# Altium schematic sheet USB3.2_Type_A.SchDoc
size A3; SheetNumber: 6; SheetTotal: 16
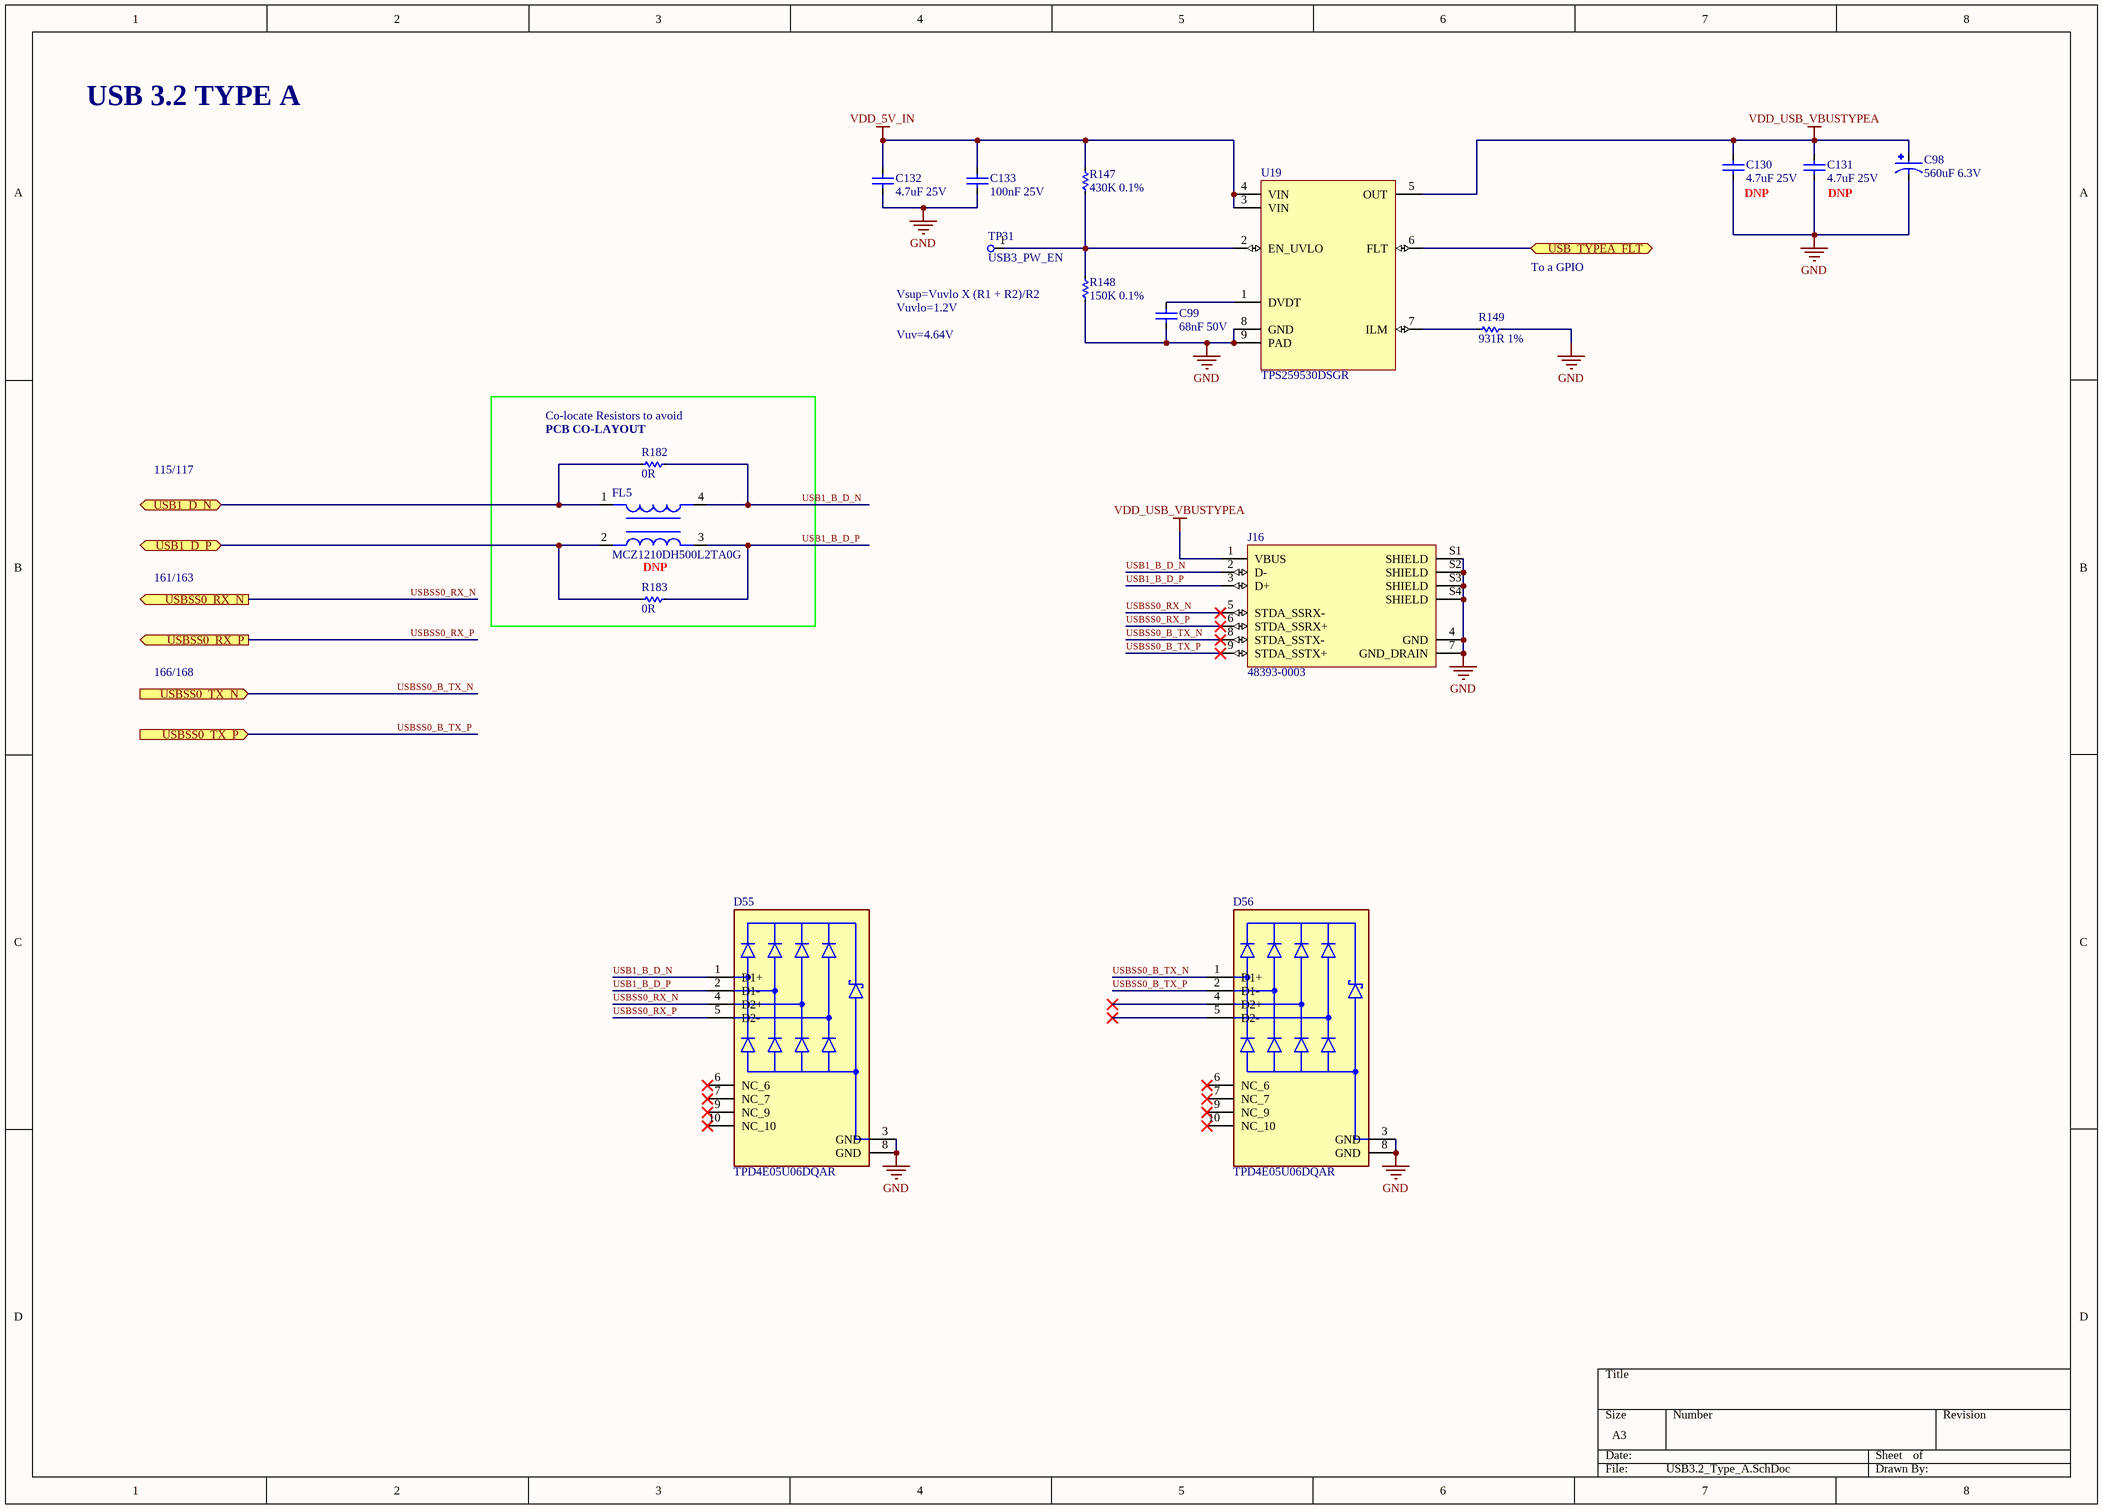
[diagram p0: USB3.2_Type_A.SchDoc]

## Parts
C98  560uF 6.3V  [CP_ELEC_8X7.7]
C99  68nF 50V  [C0805]
C130  4.7uF 25V  [C0603]
C131  4.7uF 25V  [C0603]
C132  4.7uF 25V  [C0603]
C133  100nF 25V  [C0402]
D55  TPD4E05U06DQAR  [TPD4E05U06DQAR]
D56  TPD4E05U06DQAR  [TPD4E05U06DQAR]
FL5  MCZ1210DH500L2TA0G  [MCZ1210DH500L2TA0G]
J16  48393-0003  [0483930003]
R147  430K 0.1%  [R0603]
R148  150K 0.1%  [R0402]
R149  931R 1%  [R0402]
R182  0R  [R0402]
R183  0R  [R0402]
TP31  USB3_PW_EN  [TestPoint_Pad_D1.0mm]
U19  TPS259530DSGR  [WSON(2X2)-8]

## Ports
USB1_D_N (bidir), USB1_D_P (bidir), USB_TYPEA_FLT (bidir), USBSS0_RX_N (out), USBSS0_RX_P (out), USBSS0_TX_N (in), USBSS0_TX_P (in)

## Nets
GND: C98.2(C) C99.1 C130.1 C131.1 C132.1 C133.1 D55.3(GND) D55.8(GND) D56.3(GND) D56.8(GND) J16.4(GND) J16.7(GND_DRAIN) J16.S1(SHIELD) J16.S2(SHIELD) J16.S3(SHIELD) J16.S4(SHIELD) R148.1 R149.2 U19.8(GND) U19.9(PAD)
VDD_5V_IN: C132.2 C133.2 R147.2 U19.3(VIN) U19.4(VIN)
VDD_USB_VBUSTYPEA: C98.1(A) C130.2 C131.2 J16.1(VBUS) U19.5(OUT)
USB1_B_D_N: D55.1(D1+) FL5.4 J16.2(D-) R182.2
USB1_B_D_P: D55.2(D1-) FL5.3 J16.3(D+) R183.2
USB1_D_N: FL5.1 R182.1 ; port USB1_D_N
USB1_D_P: FL5.2 R183.1 ; port USB1_D_P
USB_TYPEA_FLT: U19.6(FLT) ; port USB_TYPEA_FLT
USBSS0_B_TX_N: D56.1(D1+) J16.8(STDA_SSTX-) ; port USBSS0_TX_N
USBSS0_B_TX_P: D56.2(D1-) J16.9(STDA_SSTX+) ; port USBSS0_TX_P
USBSS0_RX_N: D55.4(D2+) J16.5(STDA_SSRX-) ; port USBSS0_RX_N
USBSS0_RX_P: D55.5(D2-) J16.6(STDA_SSRX+) ; port USBSS0_RX_P
NetC99_2: C99.2 U19.1(DVDT)
NetR147_1: R147.1 R148.2 TP31.1 U19.2(EN_UVLO)
NetR149_1: R149.1 U19.7(ILM)

Not connected (* = marked no-connect by the designer): D55 6(NC_6)* 7(NC_7)* 9(NC_9)* 10(NC_10)*; D56 4(D2+)* 5(D2-)* 6(NC_6)* 7(NC_7)* 9(NC_9)* 10(NC_10)*

## Notes on the sheet
- USB 3.2 TYPE A
- (near C130) DNP
- (near C131) DNP
- Vsup=Vuvlo X (R1 + R2)/R2
- Vuvlo=1.2V
- To a GPIO
- Vuv=4.64V
- (near R182) Co-locate Resistors to avoid
- (near R182) PCB CO-LAYOUT
- 115/117
- 161/163
- DNP
- 166/168

## Library data of the parts
C98 = RHA0J561MCN1GS: Cap Aluminum Polymer 560uF 6.3VDC 20% (8 X 7.7mm) SMD 0.009 Ohm 4500mA 2000h 105C T/R; Manufacturer: Nichicon; ESR (Equivalent Series Resistance): 9mR; Life (Hours): 2000Hour; Ripple Current: 4.5A; Leakage Current: 1.0584mA; Dissipation Factor: 0.12%; Supplier 1: Digi-Key; Manufacturer Part Number: RHA0J561MCN1GS; RoHS: Yes; Category: Polymer Capacitors; Stock 1: 37081; Pricing 1: 1=1.16000, 10=0.88500, 50=0.73500, 100=0.63290 (USD); Mount: Surface Mount; Case/Package: Radial; Min Operating Temperature: -55°C; Max Operating Temperature: 105°C; Capacitance: 560uF; Tolerance: 20%; Voltage Rating: 6.3V; Packaging: Tape and Reel; Package Quantity: 1; Voltage Rating (DC): 6.3V; Termination: SMD/SMT; Series: FPCAP, HA; Construction: Cylindrical; Diameter: 8mm; Length: 7.7mm; Width: 8.3mm; Height: 8.3mm; Height - Seated (Max): 0.303inch; Radiation Hardening: No; RoHS Compliant: Yes; ComponentLink1URL: https://datasheet.ciiva.com/16481/2009fpcap-catalog-hsha-16481370.pdf?src-supplier=Future+Electronics; ComponentLink1Description: https://datasheet.ciiva.com/16481/2009fpcap-catalog-hsha-16481370.pdf?src-supplier=Future+Electronics; ComponentLink2URL: https://datasheet.ciiva.com/101/e-hs-ha-101946.pdf?src-supplier=Digi-Key; ComponentLink2Description: https://datasheet.ciiva.com/101/e-hs-ha-101946.pdf?src-supplier=Digi-Key; ComponentLink3URL: https://datasheet.ciiva.com/101/e-hs-ha-101947.pdf?src-supplier=Digi-Key; ComponentLink3Description: https://datasheet.ciiva.com/101/e-hs-ha-101947.pdf?src-supplier=Digi-Key; ComponentLink4URL: https://datasheet.ciiva.com/101/e-hs-ha-101948.pdf?src-supplier=Digi-Key; ComponentLink4Description: https://datasheet.ciiva.com/101/e-hs-ha-101948.pdf?src-supplier=Digi-Key; Supplier Part Number 1: 493-3772-1-ND
C99 = C0805C683K5RECAUTO7210: Cap Cer 0805 68NF 50V X7R 10%; Manufacturer: KEMET; Supplier 1: Digi-Key; Manufacturer Part Number: C0805C683K5RECAUTO7210; Category: Ceramic Capacitors; Stock 1: 10000; Pricing 1: 1=0.25000, 10=0.17100, 50=0.11400, 100=0.09680, 500=0.06836, 1000=0.05981, 2500=0.05696, 5000=0.05269 (USD); RoHS Compliant: Yes; ComponentLink1URL: https://api.kemet.com/component-edge/download/datasheet/C0805C683K5RECAUTO7210.pdf?src-supplier=Digi-Key; ComponentLink1Description: https://api.kemet.com/component-edge/download/datasheet/C0805C683K5RECAUTO7210.pdf?src-supplier=Digi-Key; Supplier Part Number 1: 399-C0805C683K5RECAUTO7210CT-ND
C130-C132 = GRM188R61E475KE11D: 0603 4.7 uF 25 V ±10 % Tolerance X5R SMT Multilayer Ceramic Capacitor; Manufacturer: Murata; Tolerance: 10%; Supplier 1: Digi-Key; Manufacturer Part Number: GRM188R61E475KE11D; RoHS: Yes; Category: Ceramic Capacitors; Stock 1: 1144167; Pricing 1: 1=0.26000, 10=0.18000, 50=0.12000, 100=0.10200, 500=0.07202, 1000=0.06301 (USD); Mount: Surface Mount; Case/Package: 0603; Case Code (Metric): 1608; Case Code (Imperial): 0603; Material: Ceramic; Min Operating Temperature: -55°C; Max Operating Temperature: 85°C; Package Quantity: 1; Packaging: Cut Tape; Capacitance: 4.7uF; Voltage Rating: 25V; Dielectric: X5R; Voltage: 25V; Voltage Rating (DC): 25V; Series: GRM; Length: 0.063inch; Width: 0.031inch; Height: 0.8mm; Thickness: 0.031inch; Depth: 0.8mm; Reach SVHC Compliant: Yes; Lead Free: Lead Free; RoHS Compliant: Yes; ComponentLink1URL: https://datasheet.ciiva.com/46444/1769893-46444983.pdf?src-supplier=Element14; ComponentLink1Description: https://datasheet.ciiva.com/46444/1769893-46444983.pdf?src-supplier=Element14; ComponentLink2URL: https://datasheet.ciiva.com/46444/1769893-46444982.pdf?src-supplier=Element14; ComponentLink2Description: https://datasheet.ciiva.com/46444/1769893-46444982.pdf?src-supplier=Element14; ComponentLink3URL: https://datasheet.ciiva.com/14891/partnumbering-e-01-14891103.pdf?src-supplier=Digi-Key; ComponentLink3Description: https://datasheet.ciiva.com/14891/partnumbering-e-01-14891103.pdf?src-supplier=Digi-Key; ComponentLink4URL: https://datasheet.ciiva.com/14891/partnumbering-e-01-14891102.pdf?src-supplier=Digi-Key; ComponentLink4Description: https://datasheet.ciiva.com/14891/partnumbering-e-01-14891102.pdf?src-supplier=Digi-Key; Supplier Part Number 1: 490-7203-1-ND
C133 = TMK105BJ104KV-F: CAP CER 0.1UF 25V X5R 0402 / High Value Multilayer Ceramic Capacitors (High dielectric type); Manufacturer: Taiyo Yuden; Tolerance: 10%; Supplier 1: Digi-Key; Manufacturer Part Number: TMK105BJ104KV-F; RoHS: Yes; Category: Ceramic Capacitors; Stock 1: 11997960; Pricing 1: 1=0.10000, 10=0.03700, 50=0.02000, 100=0.01630, 500=0.01166, 1000=0.00917, 2500=0.00833, 5000=0.00767 (USD); Mount: Surface Mount; Case/Package: 0402; Number of Pins: 2; Case Code (Imperial): 0402; Case Code (Metric): 1005; Weight: 2.3E-05oz; Min Operating Temperature: -55°C; Max Operating Temperature: 85°C; Capacitance: 100nF; Packaging: Tape and Reel; Dielectric: X5R; Voltage Rating (DC): 25V; Voltage Rating: 25V; Package Quantity: 1; Termination: SMD/SMT; Resistor Type: Ceramic; Voltage: 25V; Series: M; Construction: Flat; Length: 1mm; Width: 0.02inch; Height: 0.5mm; Depth: 0.5mm; Thickness: 0.022inch; Reach SVHC Compliant: Yes; Lead Free: Lead Free; Halogen Free: Halogen Free; RoHS Compliant: Yes; Supplier Part Number 1: 587-1456-1-ND
D55 D56 = TPD4E05U06DQAR: Quad 0.5-pF, 5.5-V, ±12-kV ESD protection diode for USB, HDMI & High Speed Interfaces; Manufacturer: Texas Instruments; Direction: Unidirectional; Capacitance: 0.5pF; Number of Bidirectional Channels: 4; Reverse Standoff Voltage: 5.5V; Min Breakdown Voltage: 6V; Clamping Voltage: 14V; Peak Pulse Power: 40W; Power Line Protection: Yes; Leakage Current: 10nA; Peak Pulse Current: 2.5A; Interface: LVDS,USB,Ethernet,HDMI,PCIe,SATA; Supplier 1: Mouser; Manufacturer Part Number: TPD4E05U06DQAR; RoHS: Yes; Category: Integrated Circuits (ICs); Stock 1: 71744; Pricing 1: 1=0.66000, 10=0.58100, 50=0.54600, 100=0.44600, 1000=0.28200, 10000=0.25500 (USD); Mount: Surface Mount; Case/Package: SON; Number of Pins: 10; Contact Plating: Gold; Min Operating Temperature: -40°C; Max Operating Temperature: 125°C; Packaging: Tape and Reel; Package Quantity: 3000; Polarity: Unidirectional; Number of Channels: 4; Breakdown Voltage: 6V; Max Power Dissipation: 40W; Termination: SMD/SMT; Working Voltage: 5.5V; Operating Supply Voltage: 5.5V; Series: -; Number of Unidirectional Channels: 4; Length: 2.6mm; Depth: 1.1mm; Radiation Hardening: No; Reach SVHC Compliant: Yes; Lead Free: Lead Free; RoHS Compliant: Yes; ComponentLink1URL: https://datasheet.ciiva.com/15063/tpd4e05u06-15063653.pdf?src-supplier=Digi-Key; ComponentLink1Description: https://datasheet.ciiva.com/15063/tpd4e05u06-15063653.pdf?src-supplier=Digi-Key; ComponentLink2URL: https://datasheet.ciiva.com/24119/slvsbo7f-316827-24119436.pdf?src-supplier=Mouser; ComponentLink2Description: https://datasheet.ciiva.com/24119/slvsbo7f-316827-24119436.pdf?src-supplier=Mouser; ComponentLink3URL: https://datasheet.ciiva.com/26918/getdatasheetpartid-716763-26918024.pdf?src-supplier=Verical; ComponentLink3Description: https://datasheet.ciiva.com/26918/getdatasheetpartid-716763-26918024.pdf?src-supplier=Verical; ComponentLink4URL: https://datasheet.ciiva.com/15063/tpd4e05u06-15063654.pdf?src-supplier=Digi-Key; ComponentLink4Description: https://datasheet.ciiva.com/15063/tpd4e05u06-15063654.pdf?src-supplier=Digi-Key; ComponentLink5URL: https://datasheet.ciiva.com/15063/tpd4e05u06-15063655.pdf?src-supplier=Digi-Key; ComponentLink5Description: https://datasheet.ciiva.com/15063/tpd4e05u06-15063655.pdf?src-supplier=Digi-Key; ComponentLink6URL: https://datasheet.ciiva.com/29883/tpd4e05u06-29883798.pdf?src-supplier=Avnet; ComponentLink6Description: https://datasheet.ciiva.com/29883/tpd4e05u06-29883798.pdf?src-supplier=Avnet; Supplier Part Number 1: 595-TPD4E05U06DQAR
FL5 = MCZ1210DH500L2TA0G: 2 Line Common Mode Choke Surface Mount 50 Ohms 100mA DCR 2.5Ohm; Manufacturer: TDK; Number of Lines: 2; DC Resistance (DCR): 2.5R; Voltage Rating (DC): 5V; Supplier 1: Mouser; Manufacturer Part Number: MCZ1210DH500L2TA0G; RoHS: Yes; Category: Common Mode Chokes; Stock 1: 8170; Pricing 1: 1=0.64000, 10=0.62200, 50=0.62200, 100=0.49900, 1000=0.33900, 10000=0.24500 (USD); Mount: Surface Mount; Case Code (Metric): 3225; Case Code (Imperial): 1210; Min Operating Temperature: -40°C; Max Operating Temperature: 85°C; Packaging: Tape and Reel; Max Current Rating: 100mA; Length: 0.049inch; Width: 0.039inch; Height: 0.024inch; RoHS Compliant: Yes; ComponentLink1URL: https://product.tdk.com/info/en/catalog/datasheets/cmf_commercial_signal_mcz1210dh_en.pdf?ref_disty=digikey&src-supplier=Digi-Key; ComponentLink1Description: https://product.tdk.com/info/en/catalog/datasheets/cmf_commercial_signal_mcz1210dh_en.pdf?ref_disty=digikey&src-supplier=Digi-Key; Supplier Part Number 1: 810-MCZ1210DH500L2TG
J16 = 48393-0003: Conn USB Type A F 9 POS 2mm/2.5mm Solder RA Thru-Hole 9 Terminal 1 Port Embossed T/R; Manufacturer: Molex; Number of Terminals/Pins: 9; Gender: Receptacle; Number of Ports: 1; Max Voltage Rating (AC): 30V; Current Rating: 1.8A; USB Standard: USB 3.0; Supplier 1: Digi-Key; Manufacturer Part Number: 48393-0003; RoHS: Yes; Category: USB Connectors; Stock 1: 39734; Pricing 1: 1=4.18000, 10=3.67900, 100=2.92660 (USD); Mount: Through Hole; Contact Plating: Gold,Tin,Matte; Contact Material: Copper,Copper Alloy; Housing Material: Thermoplastic; Min Operating Temperature: -20°C; Max Operating Temperature: 85°C; Connector Type: USB; Number of Contacts: 9; Termination: Solder; Packaging: Tape and Reel; Voltage Rating: 30V; Orientation: Right Angle; Number of Circuits: 9; Series: 48393; Length: 13.8mm; Depth: 14.25mm; Halogen Free: Low Halogen; ComponentLink1URL: https://datasheet.ciiva.com/46420/1789526-46420565.pdf?src-supplier=Element14; ComponentLink1Description: https://datasheet.ciiva.com/46420/1789526-46420565.pdf?src-supplier=Element14; ComponentLink2URL: https://datasheet.ciiva.com/46420/1789526-46420566.pdf?src-supplier=Element14; ComponentLink2Description: https://datasheet.ciiva.com/46420/1789526-46420566.pdf?src-supplier=Element14; ComponentLink3URL: https://datasheet.ciiva.com/46420/1789526-46420586.pdf?src-supplier=Element14; ComponentLink3Description: https://datasheet.ciiva.com/46420/1789526-46420586.pdf?src-supplier=Element14; Supplier Part Number 1: WM10413CT-ND
R147 = CPF0603B430KE1: Res Thin Film 0603 430K Ohm 0.1% 1/16W ±25ppm/°C Molded SMD SMD Paper T/R; Manufacturer: TE Connectivity; Resistance: 430kR; Power Rating: 63mW; Voltage Rating: 50V; Number of Resistors: 1; Supplier 1: Digi-Key; Manufacturer Part Number: CPF0603B430KE1; RoHS: Yes; Category: Chip SMD Resistors; Stock 1: 37540; Pricing 1: 1=0.69000, 10=0.49000, 100=0.25450, 500=0.17622 (USD); Mount: Surface Mount; Case/Package: 0603; Case Code (Imperial): 0603; Case Code (Metric): 1608; Weight: 7.1E-05oz; Min Operating Temperature: -55°C; Max Operating Temperature: 155°C; Tolerance: 0.1%; Packaging: Tape and Reel; Resistor Type: Thin Film; Package Quantity: 1000; Termination: Solder; Temperature Coefficient: 25ppm/°C; Voltage Rating (DC): 50V; Number of Terminations: 2; Series: CPF, Neohm; Resistance Tolerance: 0.1%; Max Power Dissipation: 63mW; Length: 1.55mm; Width: 0.8mm; Height: 0.45mm; Reach SVHC Compliant: Yes; ELV: Compliant; RoHS Compliant: Yes; ComponentLink1URL: https://datasheet.ciiva.com/30239/29261eng-ds-1773200-f-30239597.pdf?src-supplier=Onlinecomponents.com; ComponentLink1Description: https://datasheet.ciiva.com/30239/29261eng-ds-1773200-f-30239597.pdf?src-supplier=Onlinecomponents.com; ComponentLink2URL: https://datasheet.ciiva.com/22670/1723857-22670871.pdf?src-supplier=Element14; ComponentLink2Description: https://datasheet.ciiva.com/22670/1723857-22670871.pdf?src-supplier=Element14; ComponentLink3URL: https://datasheet.ciiva.com/12794/eng-ds-1773200-i-12794055.pdf?src-supplier=Mouser; ComponentLink3Description: https://datasheet.ciiva.com/12794/eng-ds-1773200-i-12794055.pdf?src-supplier=Mouser; Supplier Part Number 1: A102274CT-ND
R148 = RT0402BRD07150KL: Res Thin Film 0402 150K Ohm 0.1% 1/16W ±25ppm/°C Molded SMD; Manufacturer: Yageo; Supplier 1: Digi-Key; Manufacturer Part Number: RT0402BRD07150KL; RoHS: Yes; Category: Chip SMD Resistors; Stock 1: 19814; Pricing 1: 1=0.47000, 10=0.33800, 100=0.13500, 500=0.09198, 1000=0.06654, 2500=0.06165, 5000=0.05578 (USD); RoHS Compliant: Yes; Supplier Part Number 1: 13-RT0402BRD07150KLCT-ND
R149 = RC0402FR-07931RL: Res Thick Film 0402 931 Ohm 1% 1/16W ±100ppm/°C Molded SMD Paper T/R; Manufacturer: Yageo; Voltage Rating: 50V; Power Rating: 62.5mW; Max Power Dissipation: 63mW; Supplier 1: Digi-Key; Manufacturer Part Number: RC0402FR-07931RL; RoHS: Yes; Category: Chip SMD Resistors; Stock 1: 184106; Pricing 1: 1=0.10000, 10=0.01400, 100=0.00580, 1000=0.00262, 2500=0.00228, 5000=0.00188 (USD); Case/Package: 0402; Case Code (Imperial): 0402; Case Code (Metric): 1005; Contact Plating: Tin,Matte; Size Code: 0402; Min Operating Temperature: -55°C; Max Operating Temperature: 155°C; Resistance: 931R; Tolerance: 1%; Packaging: Tape and Reel; Resistor Type: Thick Film; Number of Terminations: 2; Termination: SMD/SMT; Temperature Coefficient: 100ppm/°C; Voltage Rating (DC): 50V; Features: Moisture Resistant; Series: RC; Construction: Rectangular; Length: 1mm; Width: 0.02inch; Height: 0.016inch; Depth: 0.5mm; Military Standard: Not; Lead Free: Lead Free; RoHS Compliant: Yes; ComponentLink1URL: https://datasheet.ciiva.com/16931/pyu-rc0402-51-rohs-l-6-r-16931231.pdf?src-supplier=Future+Electronics; ComponentLink1Description: https://datasheet.ciiva.com/16931/pyu-rc0402-51-rohs-l-6-r-16931231.pdf?src-supplier=Future+Electronics; Supplier Part Number 1: YAG3259CT-ND
R182 R183 = RC0402JR-070RP: Res Jumper Thick Film 0402 0 Ohm 5% 1/16W Molded SMD Paper T/R; Manufacturer: Yageo; Resistance: 0mR; Max Power Dissipation: 63mW; Supplier 1: Digi-Key; Manufacturer Part Number: RC0402JR-070RP; RoHS: Yes; Category: Chip SMD Resistors; Stock 1: 5886851; Pricing 1: 1=0.10000, 10=0.02300, 25=0.01640, 50=0.01240, 100=0.00920, 250=0.00700, 500=0.00560, 1000=0.00412, 5000=0.00296 (USD); Case/Package: 0402; Case Code (Metric): 1005; Case Code (Imperial): 0402; Min Operating Temperature: -55°C; Max Operating Temperature: 155°C; Packaging: Tape and Reel; Resistor Type: Thick Film; Number of Terminations: 2; Features: Moisture Resistant; Length: 0.039inch; Width: 0.02inch; Height: 0.016inch; RoHS Compliant: Yes; ComponentLink1URL: http://www.yageo.com/NewPortal/yageodocoutput?fileName=/pdf/R-Chip/PYu-RC_51_RoHS_P_0.pdf&src-supplier=Digi-Key; ComponentLink1Description: http://www.yageo.com/NewPortal/yageodocoutput?fileName=/pdf/R-Chip/PYu-RC_51_RoHS_P_0.pdf&src-supplier=Digi-Key; Supplier Part Number 1: YAG1279CT-ND
TP31 = TestPoint_D1mm
U19 = TPS259530DSGR: TPS259530 12V eFuse with Fast Overvoltage Protection 2.7V to 18V 4A 34m Ohm 8-Pin WSON T/R; Manufacturer: Texas Instruments; Number of Channels: 1; Accuracy: 7.5%; Supplier 1: Mouser; Manufacturer Part Number: TPS259530DSGR; RoHS: Yes; Category: Integrated Circuits (ICs); Stock 1: 11629; Pricing 1: 1=0.97000, 10=0.87000, 50=0.82500, 100=0.67800, 1000=0.44200, 10000=0.42700 (USD); Mount: Surface Mount; Min Operating Temperature: -40°C; Max Operating Temperature: 125°C; Packaging: Tape and Reel; Output Current: 4A; RoHS Compliant: Yes; ComponentLink1URL: https://www.ti.com/lit/ds/symlink/tps2595.pdf?ts=1676530042371&ref_url=https%253A%252F%252Fwww.ti.com%252Fproduct%252FTPS2595%252Fpart-details%252FTPS259530DSGR; ComponentLink1Description: Datasheet; Supplier Part Number 1: 595-TPS259530DSGR